# Altium project HomeGear_CC2652P_Serial_Module.PrjPcb
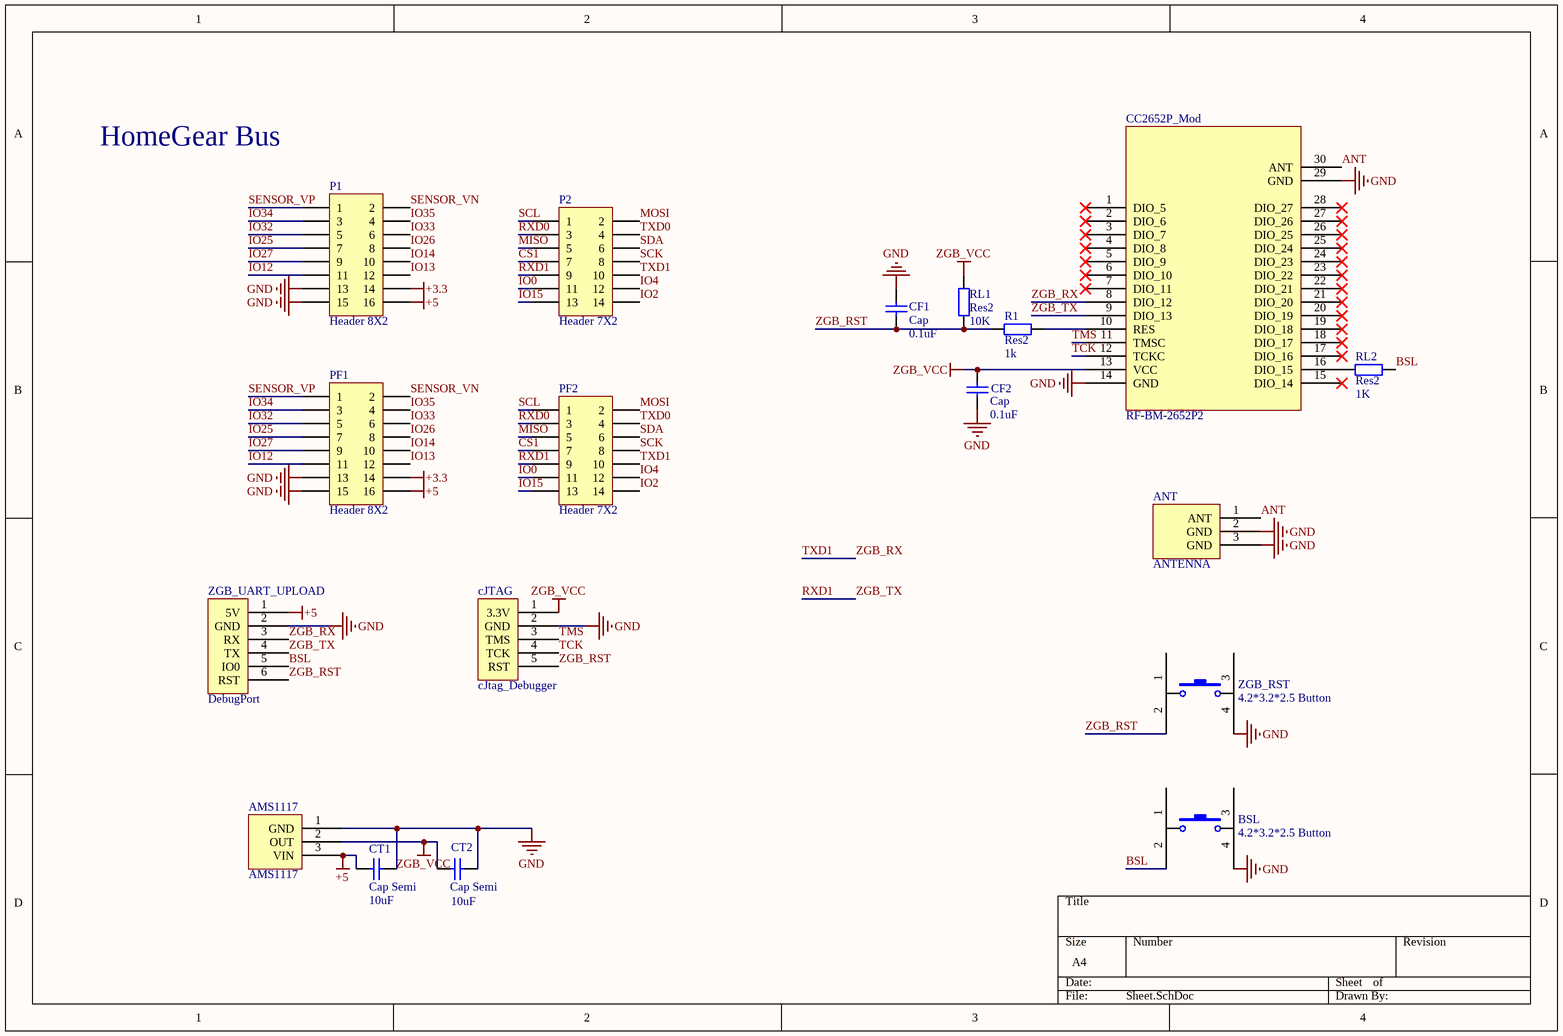
[diagram p0: Sheet.SchDoc]
1 sheet, 18 parts. Net scope: global (net labels, ports and power ports of the same name join across sheets).
Board file: PCB.PcbDoc

## Sheet Sheet.SchDoc
size A4

### Parts
AMS1117  AMS1117  [SOT-223-2]
ANT  ANTENNA  [SMA-2]
BSL  4.2*3.2*2.5 Button  [TSW 4.2*3.2*2.5]
CC2652P_Mod  RF-BM-2652P2  [RF-BM-2652P2]
CF1  Cap  value 0.1uF  [MY0603]
CF2  Cap  value 0.1uF  [MY0603]
cJTAG  cJtag_Debugger  [XH2.54-WI-5P]
CT1  Cap Semi  value 10uF  [My1206]
CT2  Cap Semi  value 10uF  [My1206]
P1  Header 8X2  [SMD_PIN_HDR8x2_2.0MM]
P2  Header 7X2  [SMD_PIN_HDR7x2_2.0MM]
PF1  Header 8X2  [SMD_FEM_HDR8x2_2.0MM]
PF2  Header 7X2  [SMD_FEM_HDR7x2_2.0MM]
R1  Res2  value 1k  [MY0603]
RL1  Res2  value 10K  [MY0603]
RL2  Res2  value 1K  [MY0603]
ZGB_RST  4.2*3.2*2.5 Button  [TSW 4.2*3.2*2.5]
ZGB_UART_UPLOAD  DebugPort  [XH2.54-WI-6P]

### Nets
+3.3: P1.14 PF1.14
+5: AMS1117.3(VIN) CT1.1 P1.16 PF1.16 ZGB_UART_UPLOAD.1(5V)
GND: AMS1117.1(GND) ANT.2(GND) ANT.3(GND) BSL.4 CC2652P_Mod.14(GND) CC2652P_Mod.29(GND) CF1.1 CF2.1 cJTAG.2(GND) CT1.2 CT2.2 P1.13 P1.15 PF1.13 PF1.15 ZGB_RST.4 ZGB_UART_UPLOAD.2(GND)
ZGB_VCC: AMS1117.2(OUT) CC2652P_Mod.13(VCC) CF2.2 cJTAG.1(3.3V) CT2.1 RL1.2
ANT: ANT.1(ANT) CC2652P_Mod.30(ANT)
BSL: BSL.2 RL2.2 ZGB_UART_UPLOAD.5(IO0)
CS1: P2.7 PF2.7
IO0: P2.11 PF2.11
IO2: P2.14 PF2.14
IO4: P2.12 PF2.12
IO12: P1.11 PF1.11
IO13: P1.12 PF1.12
IO14: P1.10 PF1.10
IO15: P2.13 PF2.13
IO25: P1.7 PF1.7
IO26: P1.8 PF1.8
IO27: P1.9 PF1.9
IO32: P1.5 PF1.5
IO33: P1.6 PF1.6
IO34: P1.3 PF1.3
IO35: P1.4 PF1.4
MISO: P2.5 PF2.5
MOSI: P2.2 PF2.2
RXD0: P2.3 PF2.3
RXD1: CC2652P_Mod.9(DIO_13) P2.9 PF2.9 ZGB_UART_UPLOAD.4(TX)  [also labelled ZGB_TX]
SCK: P2.8 PF2.8
SCL: P2.1 PF2.1
SDA: P2.6 PF2.6
SENSOR_VN: P1.2 PF1.2
SENSOR_VP: P1.1 PF1.1
TCK: CC2652P_Mod.12(TCKC) cJTAG.4(TCK)
TMS: CC2652P_Mod.11(TMSC) cJTAG.3(TMS)
TXD0: P2.4 PF2.4
TXD1: CC2652P_Mod.8(DIO_12) P2.10 PF2.10 ZGB_UART_UPLOAD.3(RX)  [also labelled ZGB_RX]
ZGB_RST: CF1.2 cJTAG.5(RST) R1.1 RL1.1 ZGB_RST.2 ZGB_UART_UPLOAD.6(RST)
NetCC2652P_Mod_10: CC2652P_Mod.10(RES) R1.2
NetCC2652P_Mod_16: CC2652P_Mod.16(DIO_15) RL2.1

Not connected (* = marked no-connect by the designer): BSL 1 3; CC2652P_Mod 1(DIO_5)* 2(DIO_6)* 3(DIO_7)* 4(DIO_8)* 5(DIO_9)* 6(DIO_10)* 7(DIO_11)* 15(DIO_14)* 17(DIO_16)* 18(DIO_17)* 19(DIO_18)* 20(DIO_19)* 21(DIO_20)* 22(DIO_21)* 23(DIO_22)* 24(DIO_23)* 25(DIO_24)* 26(DIO_25)* 27(DIO_26)* 28(DIO_27)*; ZGB_RST 1 3

### Notes on the sheet
- HomeGear Bus

### Library data of the parts
CF1 CF2 = Cap: Capacitor; Published: 8-Jun-2000; LatestRevisionDate: 17-Jul-2002; LatestRevisionNote: Re-released for DXP Platform.; PackageReference: RAD-0.3; Publisher: Altium Limited; PackageDescription: Radial Cap, Thru-Hole; 2 Leads; 0.3 in Pin Spacing
CT1 CT2 = Cap Semi: Capacitor (Semiconductor SIM Model); Published: 8-Jun-2000; LatestRevisionDate: 29-May-2009; LatestRevisionNote: IPC-7351 Footprint Added.; PackageReference: C1206; Publisher: Altium Limited; PackageDescription: Chip Capacitor
P1 PF1 = Header 8X2: Header, 8-Pin, Dual row; LatestRevisionDate: 17-Jul-2002; LatestRevisionNote: Re-released for DXP Platform.; Publisher: Altium Limited
P2 PF2 = Header 7X2: Header, 7-Pin, Dual row; LatestRevisionDate: 17-Jul-2002; LatestRevisionNote: Re-released for DXP Platform.; Publisher: Altium Limited
R1 RL1 RL2 = Res2: Resistor; Published: 8-Jun-2000; LatestRevisionDate: 17-Jul-2002; LatestRevisionNote: Re-released for DXP Platform.; PackageReference: AXIAL-0.4; Publisher: Altium Limited; PackageDescription: Axial Device, Thru-Hole; 2 Leads; 0.4 in Pin Spacing